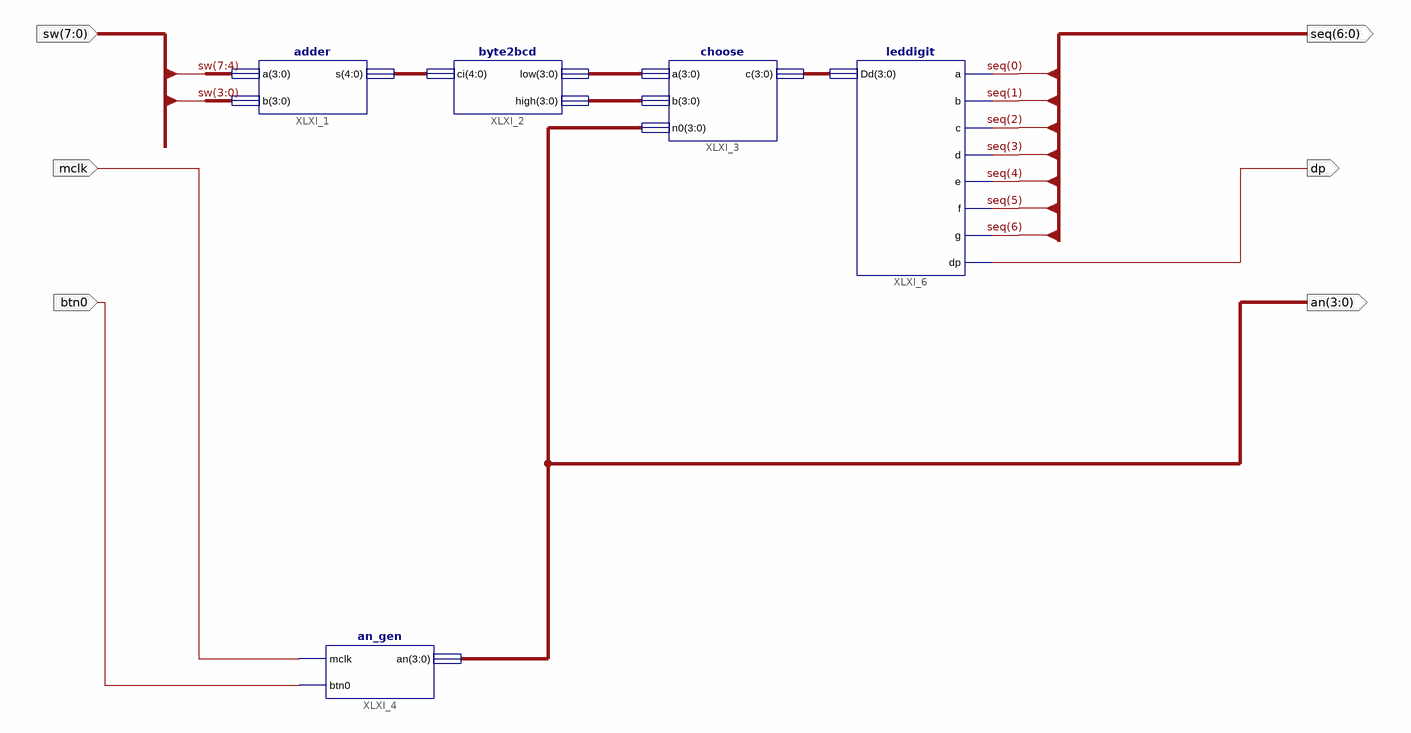
[diagram p0: schematic sheet 1]
// Xilinx ISE schematic lab2.sch (spartan3e) as structural Verilog: 5 symbols, 6 ports
module lab2 (
  input  [7:0] sw,
  input  mclk,
  input  btn0,
  output [6:0] seq,
  output dp,
  output [3:0] an
);

  wire [3:0] XLXN_11, XLXN_12, XLXN_20;
  wire [4:0] XLXN_10;

  adder XLXI_1 (.a(sw[7:4]), .b(sw[3:0]), .s(XLXN_10));
  byte2bcd XLXI_2 (.ci(XLXN_10), .low(XLXN_11), .high(XLXN_12));
  choose XLXI_3 (.a(XLXN_11), .b(XLXN_12), .n0(an), .c(XLXN_20));
  an_gen XLXI_4 (.mclk(mclk), .btn0(btn0), .an(an));
  leddigit XLXI_6 (
    .Dd(XLXN_20), .a(seq[0]), .b(seq[1]), .c(seq[2]), .d(seq[3]), .e(seq[4]), .f(seq[5]), .g(seq[6]), .dp(dp));
endmodule
